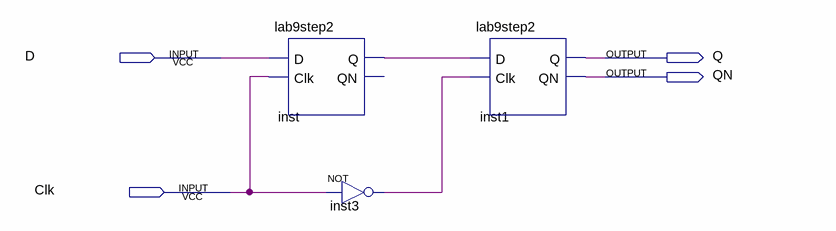
[diagram p0: schematic sheet]
// Quartus schematic lab9step3a.bdf as structural Verilog: 3 symbols, 4 pins
module lab9step3a (
  input  D,
  input  Clk,
  output Q,
  output QN
);

  wire inst3_out, inst_q;

  lab9step2 inst (.D(D), .Clk(Clk), .Q(inst_q));  // open: QN
  not inst3 (inst3_out, Clk);
  lab9step2 inst1 (.D(inst_q), .Clk(inst3_out), .Q(Q), .QN(QN));
endmodule
